# EAGLE schematic hunger cube (EAGLE 6.4)
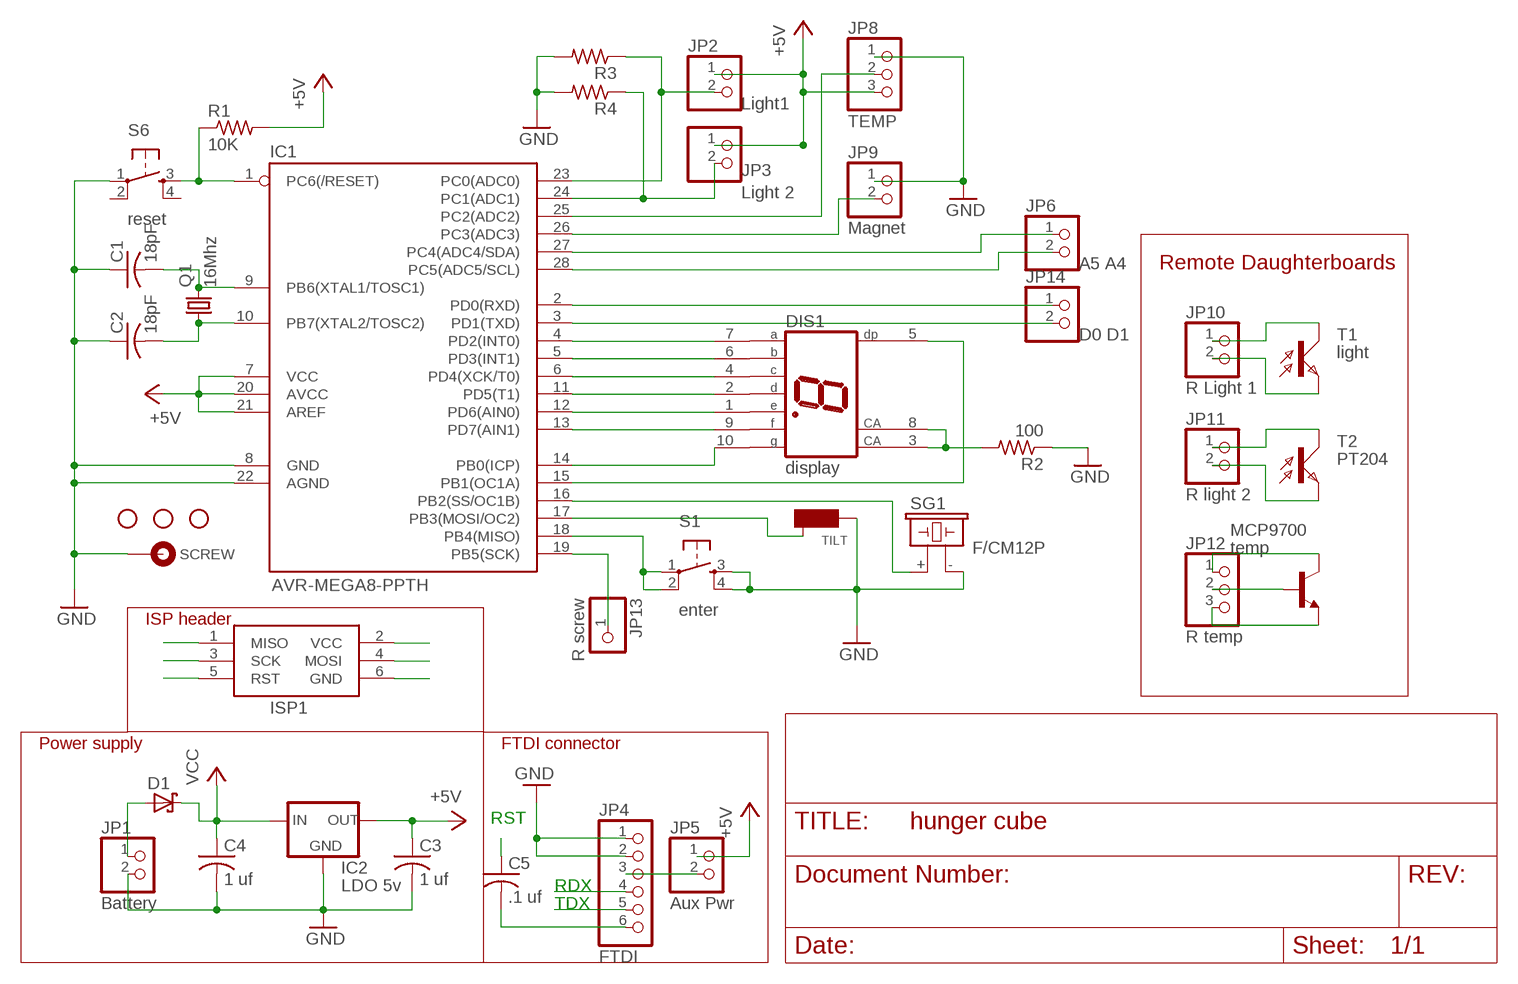
[diagram p0: schematic, sheet 1]

## Parts
C1  18pF  C-US025-050X050  [C025-050X050]
C2  18pF  C-US025-050X050  [C025-050X050]
C3  1 uf  C-US025-050X050  [C025-050X050]
C4  1 uf  C-US025-050X050  [C025-050X050]
C5  .1 uf  C-US025-050X050  [C025-050X050]
D1  SCHOTTKY-DIODEDO41  [DO41-10]
DIS1  display  HD-H101  [HDSP-M]
IC1  AVR-MEGA8-PPTH  [DIL28-3]
IC2  LDO 5v  MCP1700INLINE  [TO92-INLINE]
ISP1  AVRISP-6  [AVRISP]
JP1  Battery  PINHD-1X2  [1X02]
JP2  Light1  PINHD-1X2  [1X02]
JP3  Light 2  PINHD-1X2  [1X02]
JP4  FTDI  PINHD-1X6  [1X06]
JP5  Aux Pwr  PINHD-1X2  [1X02]
JP6  A5 A4  PINHD-1X2  [1X02]
JP7  Connected screw hole  CONNECTED-SCREW-HOLE  [SCREW-HOLE-PAD]
JP8  TEMP  PINHD-1X3  [1X03]
JP9  Magnet  PINHD-1X2  [1X02]
JP10  R Light 1  PINHD-1X2  [1X02]
JP11  R light 2  PINHD-1X2  [1X02]
JP12  R temp  PINHD-1X3  [1X03]
JP13  R screw  PINHD-1X1  [1X01]
JP14  D0 D1  PINHD-1X2  [1X02]
MCP9700  temp  -NPN-TO92-EBC  [TO92-EBC]
Q1  16Mhz  CRYSTALHC49US  [HC49US]
R1  10K  R-US_0207/12  [0207/12]
R2  100  R-US_0207/12  [0207/12]
R3  R-US_0207/12  [0207/12]
R4  R-US_0207/12  [0207/12]
S1  enter  TAC_SWITCHPTH  [TACTILE-PTH]
S6  reset  TAC_SWITCHPTH  [TACTILE-PTH]
SG1  F/CM12P  [F/CM12P]
ST1  STAND-OFF  [STAND-OFF]
ST2  STAND-OFF  [STAND-OFF]
ST3  STAND-OFF  [STAND-OFF]
T1  light  BPX81  [BPX81]
T2  PT204  BPX81  [BPX81]
TILT  TILT-SENSOR  [TILT]

## Nets
+5V: C3.1 IC1.7(VCC) IC1.20(AVCC) IC1.21(AREF) IC2.3(OUT) ISP1.2(VCC) JP2.1 JP3.1 JP5.1 JP8.3 R1.2
A0-LIGHT1: IC1.23(PC0(ADC0)) JP2.2 R3.1
A1-LIGHT2: IC1.24(PC1(ADC1)) JP3.2 R4.1
A2-TEMP: IC1.25(PC2(ADC2)) JP8.2
A3-MAGNET: IC1.26(PC3(ADC3)) JP9.2
A4: IC1.27(PC4(ADC4/SDA)) JP6.1
A5: IC1.28(PC5(ADC5/SCL)) JP6.2
D0-RDX: IC1.2(PD0(RXD)) JP4.4 JP14.1
D1-TDX: IC1.3(PD1(TXD)) JP4.5 JP14.2
D2-SEGA: DIS1.7(A) IC1.4(PD2(INT0))
D3-SEBB: DIS1.6(B) IC1.5(PD3(INT1))
D4-SEGC: DIS1.4(C) IC1.6(PD4(XCK/T0))
D5-SEGD: DIS1.2(D) IC1.11(PD5(T1))
D6-SEGE: DIS1.1(E) IC1.12(PD6(AIN0))
D7-SEGF: DIS1.9(F) IC1.13(PD7(AIN1))
D8-SEGG: DIS1.10(G) IC1.14(PB0(ICP))
D9-DP: DIS1.5(DP) IC1.15(PB1(OC1A))
D10-BUZZER: IC1.16(PB2(SS/OC1B)) SG1.+
D11-MOSI-TILT: IC1.17(PB3(MOSI/OC2)) ISP1.4(MOSI) TILT.SLEEVE
D12-MISO-ENTER: IC1.18(PB4(MISO)) ISP1.1(MISO) S1.1 S1.2
D13-SCK-SCREW: IC1.19(PB5(SCK)) ISP1.3(SCK) JP13.1
DSP-GND: DIS1.3(CA) DIS1.8(CA) R2.2
GND: C1.1 C2.1 C3.2 C4.2 IC1.8(GND) IC1.22(AGND) IC2.1(GND) ISP1.6(GND) JP1.2 JP4.1 JP4.2 JP7.SCREW JP8.1 JP9.1 R2.1 R3.2 R4.2 S1.3 S1.4 S6.1 SG1.- TILT.CENTER
N$1: C5.2 JP4.6
N$2: D1.A JP1.1
N$3: C1.2 IC1.9(PB6(XTAL1/TOSC1)) Q1.2
N$4: C2.2 IC1.10(PB7(XTAL2/TOSC2)) Q1.1
N$5: JP4.3 JP5.2
N$13: JP10.2 T1.E
N$15: JP11.2 T2.E
N$16: JP11.1 T2.C
N$17: JP10.1 T1.C
N$20: JP12.3 MCP9700.E
N$21: JP12.2 MCP9700.B
N$22: JP12.1 MCP9700.C
RST: C5.1 IC1.1(PC6(/RESET)) ISP1.5(RST) R1.1 S6.3
VCC: C4.1 D1.C IC2.2(IN)
Unconnected: S6.2 S6.4

## Notes on the sheet
- Remote Daughterboards
- ISP header
- Power supply | FTDI connector
- RST
- RDX
- TDX

## Library data of the parts
C1-C5 = resistor:C-US: CAPACITOR, American symbol
D1 = adafruit:SCHOTTKY-DIODE: Schottky Diode
DIS1 = display-hp:HD-H101: LED DISPLAY 1-character 7 segment, decimal point right; OC_FARNELL: unknown; OC_NEWARK: unknown
IC1 = SparkFun:AVR-MEGA8-P: MICROCONTROLLER 8 Kbytes FLASH 1 kbytes SRAM 512 bytes EEPROM USART 4-channel 10 bit ADC 2-channel 8 bit ADC
IC2 = adafruit:MCP1700: VOLTAGE REGULATOR
ISP1 = adafruit:AVRISP: AVR ISP HEADER Standard 6 pin header for AVR programming
JP1-JP3 JP5 JP6 JP9-JP11 JP14 = pinhead:PINHD-1X2: PIN HEADER
JP4 = pinhead:PINHD-1X6: PIN HEADER
JP7 = connected-screw:CONNECTED-SCREW-HOLE
JP8 JP12 = pinhead:PINHD-1X3: PIN HEADER
JP13 = pinhead:PINHD-1X1: PIN HEADER
MCP9700 = transistor:*-NPN-: NPN Transistror BF959 corrected 2008.03.06
Q1 = SparkFun:CRYSTAL: Crystals Various standard crystals. Proven footprints. Spark Fun Electronics SKU : COM-00534
R1-R4 = resistor:R-US_: RESISTOR, American symbol
S1 S6 = SparkFun:TAC_SWITCH: Momentary Switch Button commonly used for reset or general input. Spark Fun Electronics SKU : COM-00097
SG1 = buzzer:F/CM12P: BUZZER Source: Buerklin; OC_FARNELL: unknown; OC_NEWARK: unknown
ST1-ST3 = SparkFun:STAND-OFF: Stand Off This is the mechanical footprint for a #4 phillips button head screw. Use the keepout ring to avoid running the screw head into surrounding components. SKU : PRT-00447
T1 T2 = opto-trans-siemens:BPX81: PHOTO TRANSISTOR; OC_FARNELL: unknown; OC_NEWARK: unknown
TILT = tilt-sensor:TILT-SENSOR